# EAGLE design motherboard (EAGLE 9.6.2)
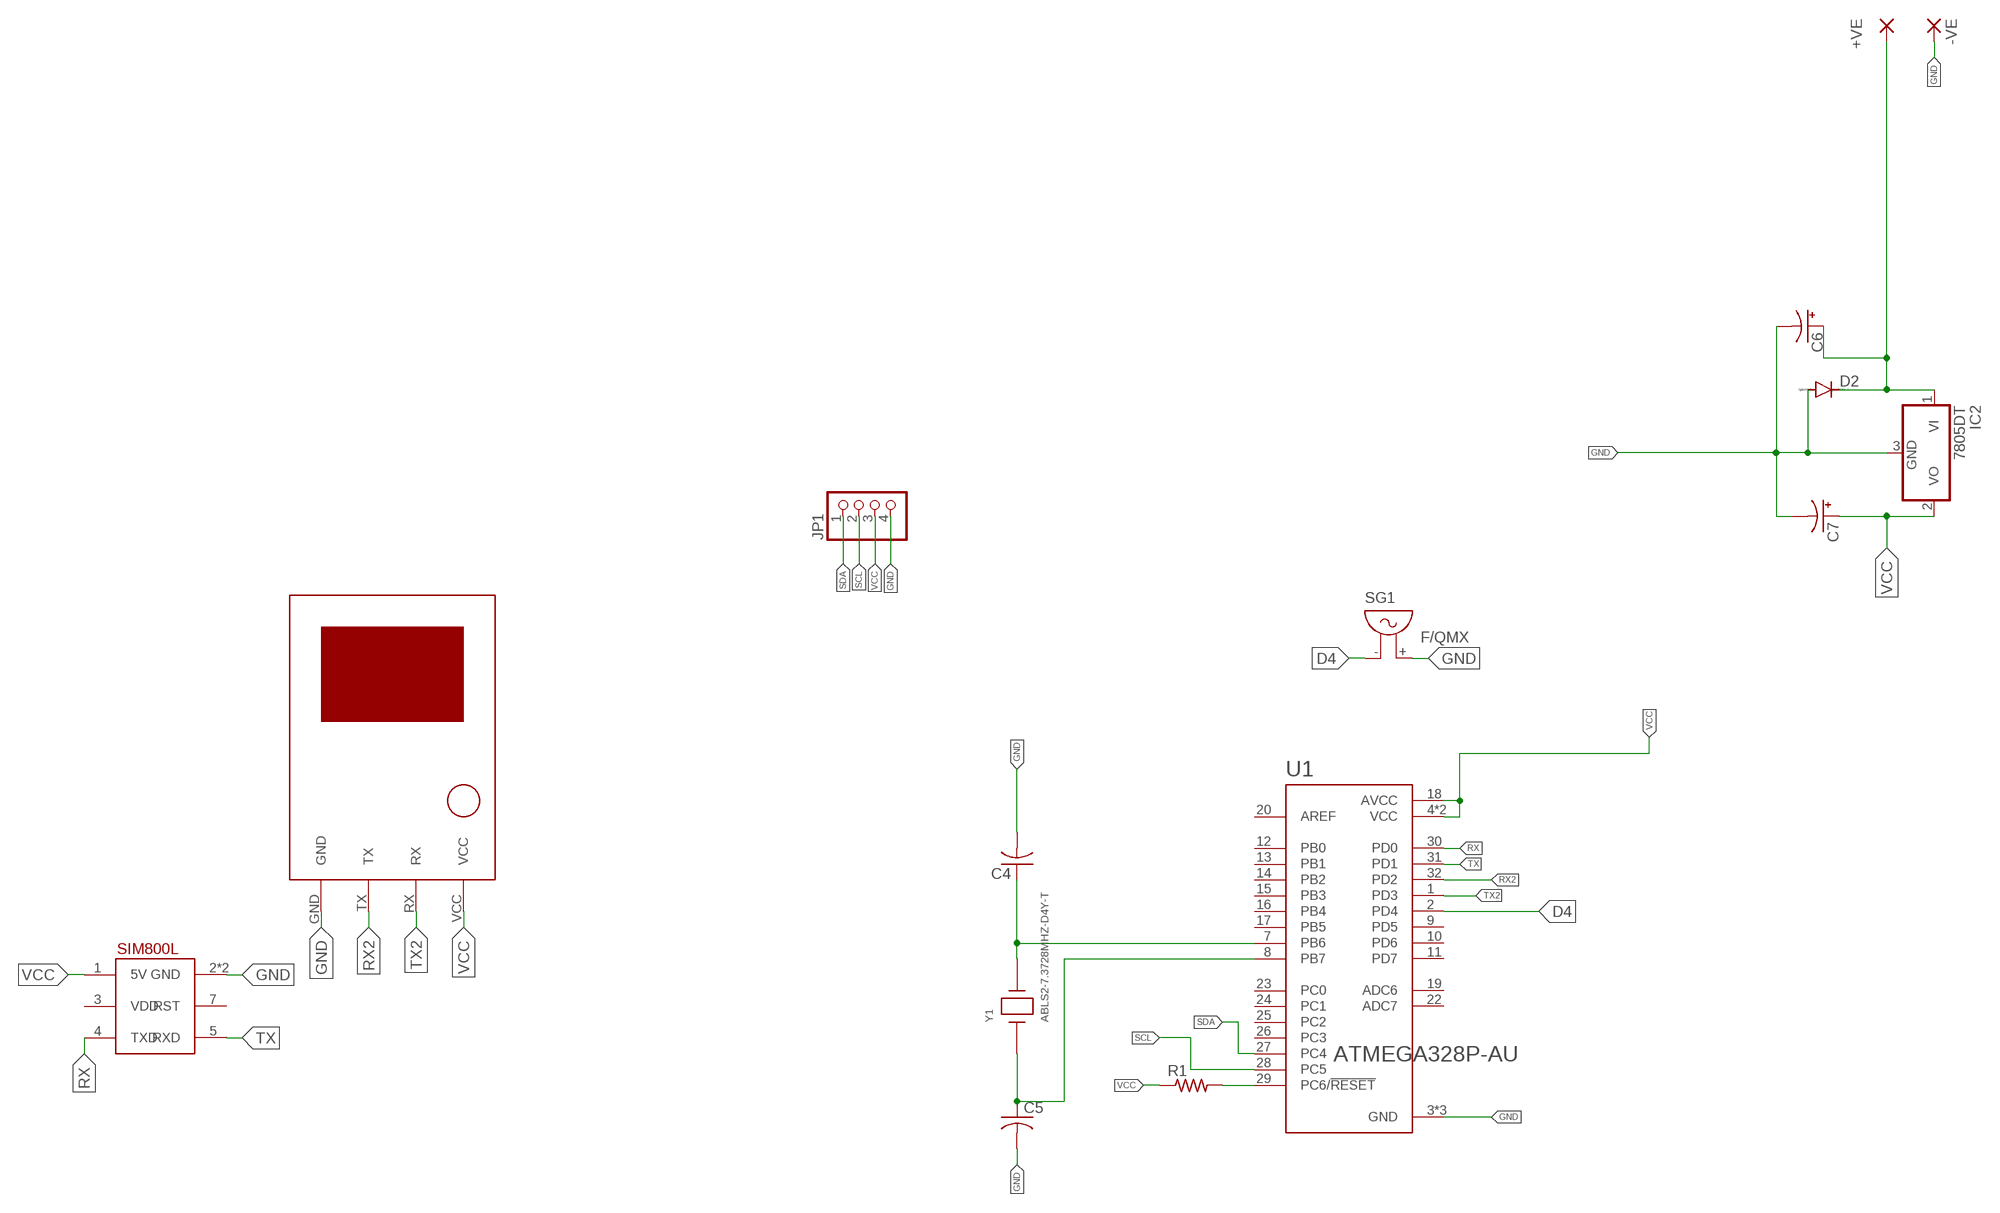
[diagram p0: schematic, sheet 1]

## Parts
+VE  WIREPAD1,6/0,8  [1,6/0,8]
-VE  WIREPAD1,6/0,8  [1,6/0,8]
C4  C-US025-024X044  [C025-024X044]
C5  C-US025-024X044  [C025-024X044]
C6  CPOL-US153CLV-1010  [153CLV-1010]
C7  CPOL-US153CLV-1010  [153CLV-1010]
D2  DIODE-DO214AC  [DO214AC]
IC2  7805DT  [TO252]
JP1  PINHD-1X4  [1X04]
R1  R-US_R0603  [R0603]
SG1  F/QMX  [F/QMX]
U1  ATMEGA328P-AU  [QFP80P900X900X120-32N]
U$1  U-BLOX-NEO6V2  [U-BLOX-NEO6V2]
U$2  SIM800L  [SIP]
Y1  ABLS2-7.3728MHZ-D4Y-T  [XTAL_ABLS2-7.3728MHZ-D4Y-T]

## Nets
D4: SG1.- U1.2(PD4)
GND: -VE.1(P) C4.2 C5.2 C6.- C7.- D2.A IC2.3(GND) JP1.4 SG1.+ U1.3(GND) U1.5(GND) U1.21(GND) U$1.GND U$2.2(GND) U$2.6(GND)
N$1: +VE.1(P) C6.+ D2.C IC2.1(VI)
N$3: C4.1 U1.7(PB6) Y1.2
N$5: C5.1 U1.8(PB7) Y1.1
N$7: R1.2 U1.29(PC6/!RESET)
RX: U1.30(PD0) U$2.4(TXD)
RX2: U1.32(PD2) U$1.TX
SCL: JP1.2 U1.28(PC5)
SDA: JP1.1 U1.27(PC4)
TX: U1.31(PD1) U$2.5(RXD)
TX2: U1.1(PD3) U$1.RX
VCC: C7.+ IC2.2(VO) JP1.3 R1.1 U1.4(VCC) U1.6(VCC) U1.18(AVCC) U$1.VCC U$2.1(5V)
Unconnected: U1.9(PD5) U1.10(PD6) U1.11(PD7) U1.12(PB0) U1.13(PB1) U1.14(PB2) U1.15(PB3) U1.16(PB4) U1.17(PB5) U1.19(ADC6) U1.20(AREF) U1.22(ADC7) U1.23(PC0) U1.24(PC1) U1.25(PC2) U1.26(PC3) U$2.3(VDD) U$2.7(RST)

## Library data of the parts
+VE -VE = wirepad:WIREPAD: Wire PAD connect wire on PCB
C4 C5 = rcl:C-US: CAPACITOR, American symbol; SPICEPREFIX: C
C6 C7 = rcl:CPOL-US: POLARIZED CAPACITOR, American symbol; SPICEPREFIX: C
D2 = diode:DIODE-: DIODE
IC2 = linear4:78*: Positive VOLTAGE REGULATOR
JP1 = pinhead:PINHD-1X4: PIN HEADER
R1 = rcl:R-US_: RESISTOR, American symbol; SPICEPREFIX: R
SG1 = buzzer:F/QMX: BUZZER Source: Buerklin; OC_FARNELL: unknown; OC_NEWARK: unknown
U1 = ATMEGA328P-AU:ATMEGA328P-AU: ATmega Series 20 MHz 32 KB Flash 2 KB SRAM 8-Bit Microcontroller - TQFP-32 Check prices <https://pricing.snapeda.com/parts/ATMEGA328P-AU/Microchip%20Technology/view-part?ref=eda>; AVAILABILITY: Good; DESCRIPTION: AVR AVR® ATmega Microcontroller IC 8-Bit 20MHz 32KB (16K x 16) FLASH 32-TQFP (7x7); MF: Microchip Technology; MP: ATMEGA328P-AU; PACKAGE: TQFP-32 Microchip; PRICE: None; PURCHASE-URL: https://pricing.snapeda.com/search/part/ATMEGA328P-AU/?ref=eda
U$1 = u-blox neo-6m v2:U-BLOX-NEO6V2
U$2 = sim800l:SIM800L: SIM800L Blue EVB Board with Level Translation and diode dropper.
Y1 = ABLS2-7.3728MHZ-D4Y-T:ABLS2-7.3728MHZ-D4Y-T: Crystal 24MHz Ø¢Â±30ppm (Tol) Ø¢Â±30ppm (Stability) 18pF FUND 40Ohm 2-Pin HC-49/US SMD T/R Check prices <https://pricing.snapeda.com/parts/ABLS2-7.3728MHZ-D4Y-T/Abracon/view-part?ref=eda>; AVAILABILITY: Good; DESCRIPTION: 7.3728MHz ±30ppm Crystal 18pF 100 Ohms HC-49/US; MF: Abracon; MP: ABLS2-7.3728MHZ-D4Y-T; PACKAGE: HC49/US Abracon; PRICE: None; PURCHASE-URL: https://pricing.snapeda.com/search/part/ABLS2-7.3728MHZ-D4Y-T/?ref=eda

## Board
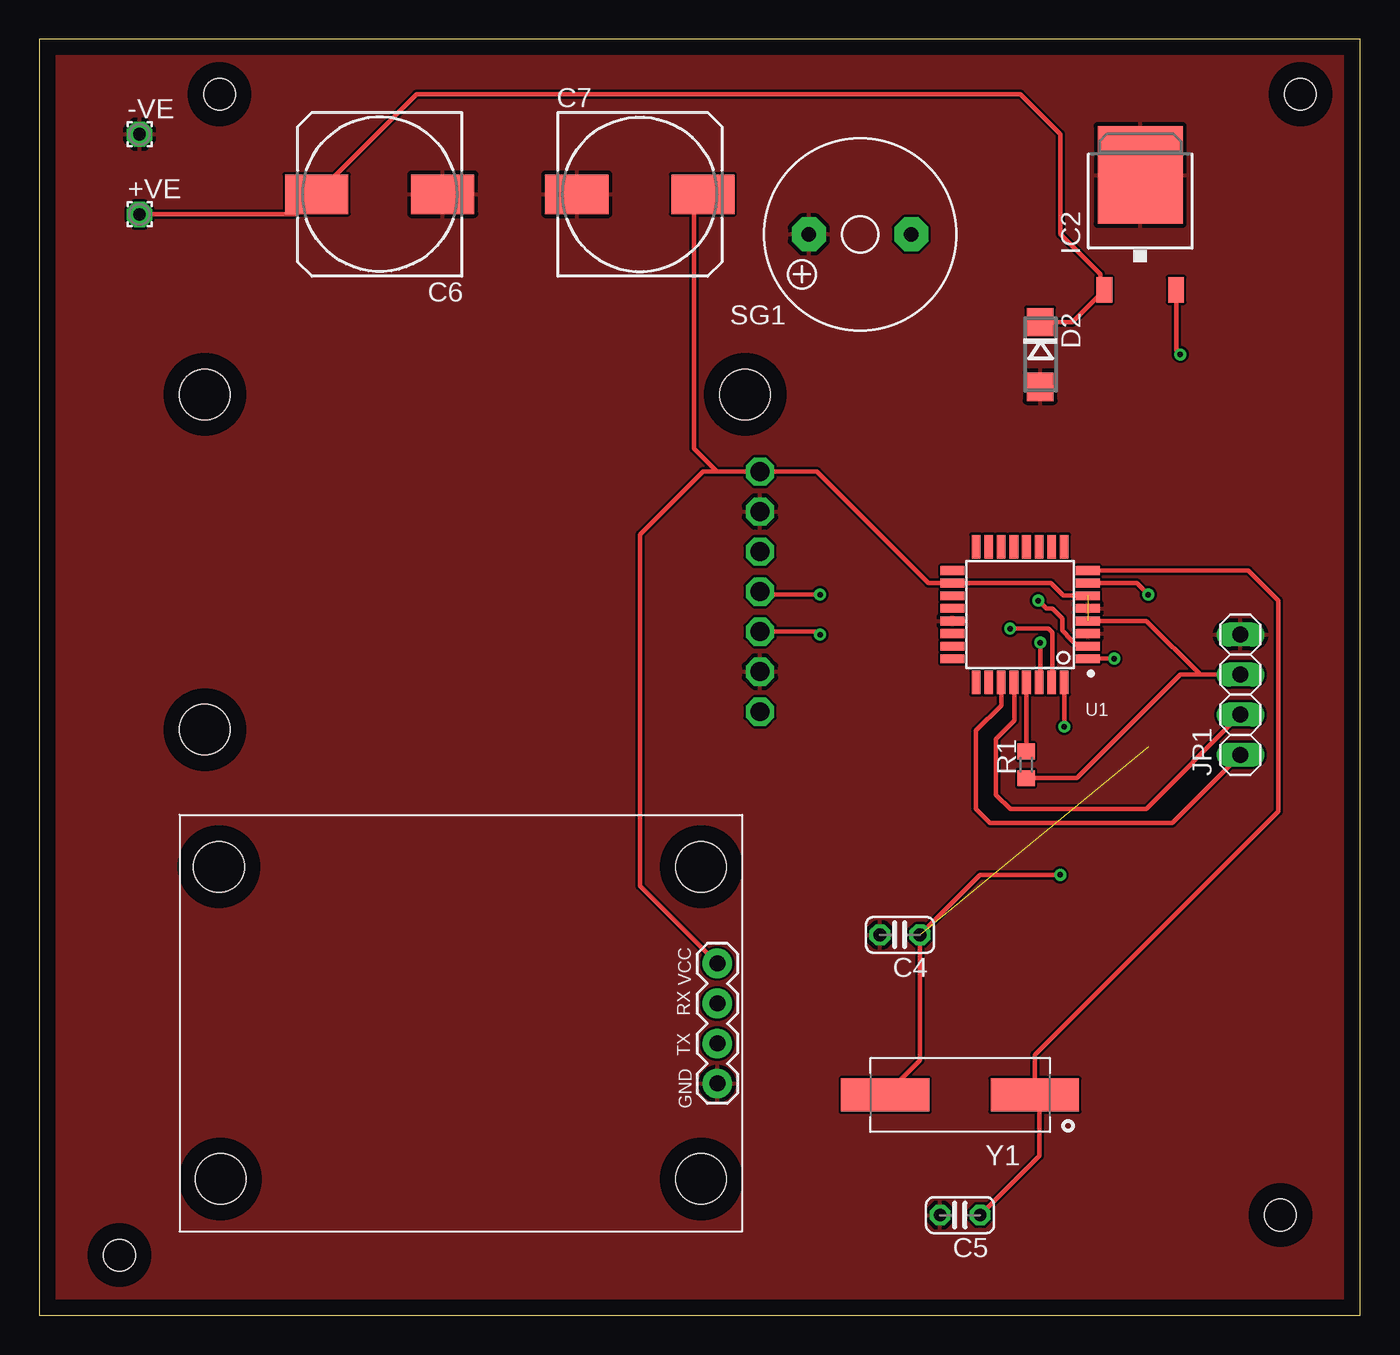
[diagram p1: board, top side]
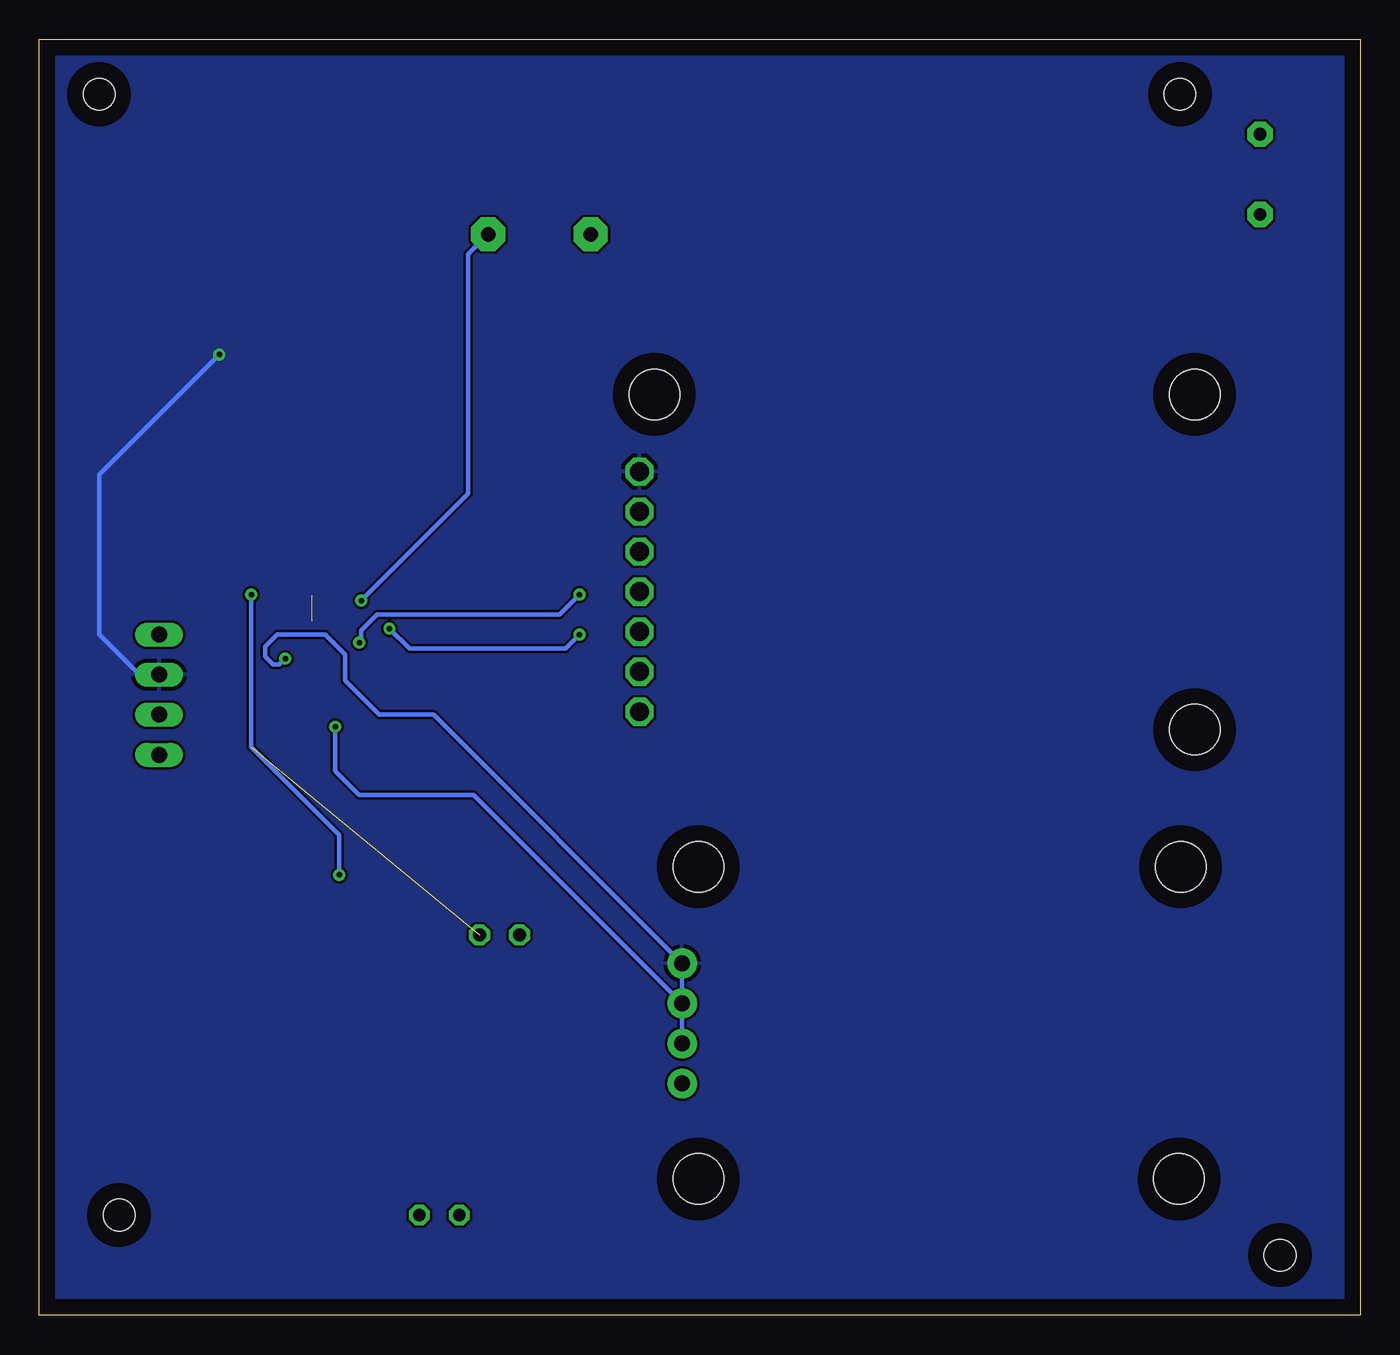
[diagram p2: board, bottom side, seen from below]

Size 83.8 x 80.95 mm. Coordinates in mm from the lower left corner, seen from the top.
Outline: 0,0 83.8,0 83.8,80.95 0,80.95 0,0
Copper layers (1*16): Top 0.035mm / dielectric 1.5mm / Bottom 0.035mm
Design rules "default": minimum track width 6mil, minimum drill 0.35mm, track to track 6mil, track to pad 6mil, pad to pad 6mil, via to via 6mil, smd to smd 6mil, copper to edge 40mil, drill to drill 6mil, minimum pad ring 10mil, minimum via ring 8mil, stop-mask expansion 4mil, vias tented up to drill 0mil, thermal gap 10mil
Holes 2 mm at 11.43,77.47 80.01,77.47 78.74,6.35 5.08,3.81

### Footprints (pad centres in the part's own frame; a part is rotated, then mirrored left to right if it is on the bottom)
1,6/0,8 = drill 0.813 pad 1.6 octagon: 1 0,0
C025-024X044 = drill 0.813 octagon: 1 -1.27,0; 2 1.27,0
153CLV-1010 = smd 4 x 2.5: + 4,0; - -4,0
DO214AC = smd 1.8 x 1.7: A 2.05,0; C -2.05,0
TO252 = smd 1 x 1.6: 1 -2.28,-4.8; 2 2.28,-4.8 | smd 5.4 x 6.2: 3 0,2.5
1X04 = drill 1.016 long: 1 -3.81,0; 2 -1.27,0; 3 1.27,0; 4 3.81,0
R0603 = smd 1 x 1.1: 1 -0.85,0; 2 0.85,0
F/QMX = drill 0.914 pad 2.159 octagon: + 3.251,0; - -3.251,0
QFP80P900X900X120-32N = smd 1.5 x 0.55: 1 -4.3,2.8; 2 -4.3,2; 3 -4.3,1.2; 4 -4.3,0.4; 5 -4.3,-0.4; 6 -4.3,-1.2; 7 -4.3,-2; 8 -4.3,-2.8; 17 4.3,-2.8; 18 4.3,-2; 19 4.3,-1.2; 20 4.3,-0.4; 21 4.3,0.4; 22 4.3,1.2; 23 4.3,2; 24 4.3,2.8 | smd 0.55 x 1.5: 9 -2.8,-4.3; 10 -2,-4.3; 11 -1.2,-4.3; 12 -0.4,-4.3; 13 0.4,-4.3; 14 1.2,-4.3; 15 2,-4.3; 16 2.8,-4.3; 25 2.8,4.3; 26 2,4.3; 27 1.2,4.3; 28 0.4,4.3; 29 -0.4,4.3; 30 -1.2,4.3; 31 -2,4.3; 32 -2.8,4.3
U-BLOX-NEO6V2 = drill 1.016 pad 1.88: GND 17.05,34.13; RX 11.97,34.13; TX 14.51,34.13; VCC 9.43,34.13 | hole 3.2: 3.3,33.1; 23.1,33.1; 3.3,2.5; 23.1,2.6
SIP = drill 1.2 octagon: 1 38.1,19.24; 2 38.1,16.7; 3 38.1,14.16; 4 38.1,11.62; 5 38.1,9.08; 6 38.1,6.54; 7 38.1,4 | hole 3.2: 2.87,24.13; 2.87,2.87; 37.16,24.13
XTAL_ABLS2-7.3728MHZ-D4Y-T = smd 5.6 x 2.1: 1 -4.75,0; 2 4.75,0

### Placement (x,y rotation side)
+VE  6.35,69.85 0 top
-VE  6.35,74.93 0 top
C4  54.61,24.13 180 top
C5  58.42,6.35 180 top
C6  21.59,71.12 180 top
C7  38.1,71.12 0 top
D2  63.5,60.96 270 top
IC2  69.85,69.85 0 top
JP1  76.2,39.37 90 top
R1  62.61,34.92 90 top
SG1  52.07,68.58 180 top
U1  62.23,44.45 180 top
U$1  8.89,31.75 270 top
U$2  7.62,34.29 0 top
Y1  58.42,13.97 180 top

### Tracks (layer width: path | path; a pad name or v marks a point on that pad's centre or on a via)
D4  (via drill 0.35)
  Top 0.3: U1.2 65.88,42.45 65.48,42.85 64.9,43.43 64.9,44.2 64.26,44.83 63.88,44.83 v63.37,45.34
  Bottom 0.3: v63.37,45.34 56.59,52.12 56.59,67.31 SG1.-
GND
  pour Top: -7.62,85.09 93.98,85.09 93.98,1.27 90.17,-2.54 85.09,-7.62 -1.27,-7.62 -7.62,-1.27
N$1
  Top 0.3: +VE.1 16.32,69.85 C6.+ 23.94,77.47 62.23,77.47 64.77,74.93 64.77,68.58 67.31,66.04 67.31,65.05 IC2.1 65.53,63.01 D2.C
N$3  (via drill 0.35)  (1 unrouted)
  Top 0.3: Y1.2 55.88,16.18 C4.1 59.69,27.94 v64.77,27.94 | v70.36,45.72 69.63,46.45 U1.7
  Bottom 0.3: v64.77,27.94 64.77,30.48 70.36,36.07 v70.36,45.72
N$5
  Top 0.152: 63.44,10.1 63.5,10.16
  Top 0.3: C5.1 63.44,10.1 63.44,13.7 Y1.1 63.17,16.51 78.61,31.95 78.61,45.34 76.7,47.25 U1.8
N$7
  Top 0.3: R1.2 62.61,40.13 U1.29
RX  (via drill 0.35)
  Top 0.3: U$2.4 45.91,45.72 v49.53,45.72 | v63.5,42.67 63.5,40.22 U1.30
  Bottom 0.3: v49.53,45.72 50.8,44.45 62.36,44.45 63.37,43.43 63.37,42.67 v63.5,42.67
RX2  (via drill 0.35)
  Top 0.3: v65.02,37.34 U1.32
  Bottom 0.3: U$1.TX 43.02,19.78 56.26,33.02 63.5,33.02 65.02,34.54 v65.02,37.34
SCL
  Top 0.3: JP1.2 70.23,32.13 61.59,32.13 60.71,33.02 60.71,36.58 61.85,37.72 61.85,40.13 U1.28
SDA
  Top 0.3: U1.27 61.03,38.68 59.44,37.08 59.44,32.13 60.33,31.24 71.88,31.24 JP1.1
TX  (via drill 0.35)
  Top 0.3: U$2.5 49.34,43.37 v49.53,43.18 | v61.59,43.56 64.01,43.56 64.26,43.31 64.26,40.18 U1.31
  Bottom 0.3: v61.59,43.56 60.33,42.29 50.42,42.29 v49.53,43.18
TX2  (via drill 0.35)
  Top 0.3: v68.2,41.66 U1.1
  Bottom 0.3: U$1.RX 43.02,22.32 58.8,38.1 62.23,38.1 64.39,40.26 64.39,41.91 65.66,43.18 68.71,43.18 69.47,42.42 69.47,41.78 68.96,41.27 68.58,41.27 v68.2,41.66
VCC  (via drill 0.35)  (1 unrouted)
  Top 0.3: C7.+ 41.53,70.55 41.53,54.99 42.99,53.53 | 42.99,53.53 U$2.1 49.34,53.53 56.42,46.45 U1.18 64.17,46.45 64.97,45.65 U1.6 | U1.4 70.25,44.05 73.66,40.64 | 73.66,40.64 JP1.3 | U$1.VCC 38.1,27.24 38.1,49.53 42.1,53.53 42.99,53.53 | R1.1 65.83,34.08 72.39,40.64 73.66,40.64 | IC2.2 72.13,61.22 v72.39,60.96
  Bottom 0.3: v72.39,60.96 80.01,53.34 80.01,43.18 77.47,40.64 JP1.3
  pour Bottom: -8.89,87.63 95.25,87.63 99.06,83.82 99.06,11.43 81.28,-6.35 -3.81,-6.35 -8.89,-1.27